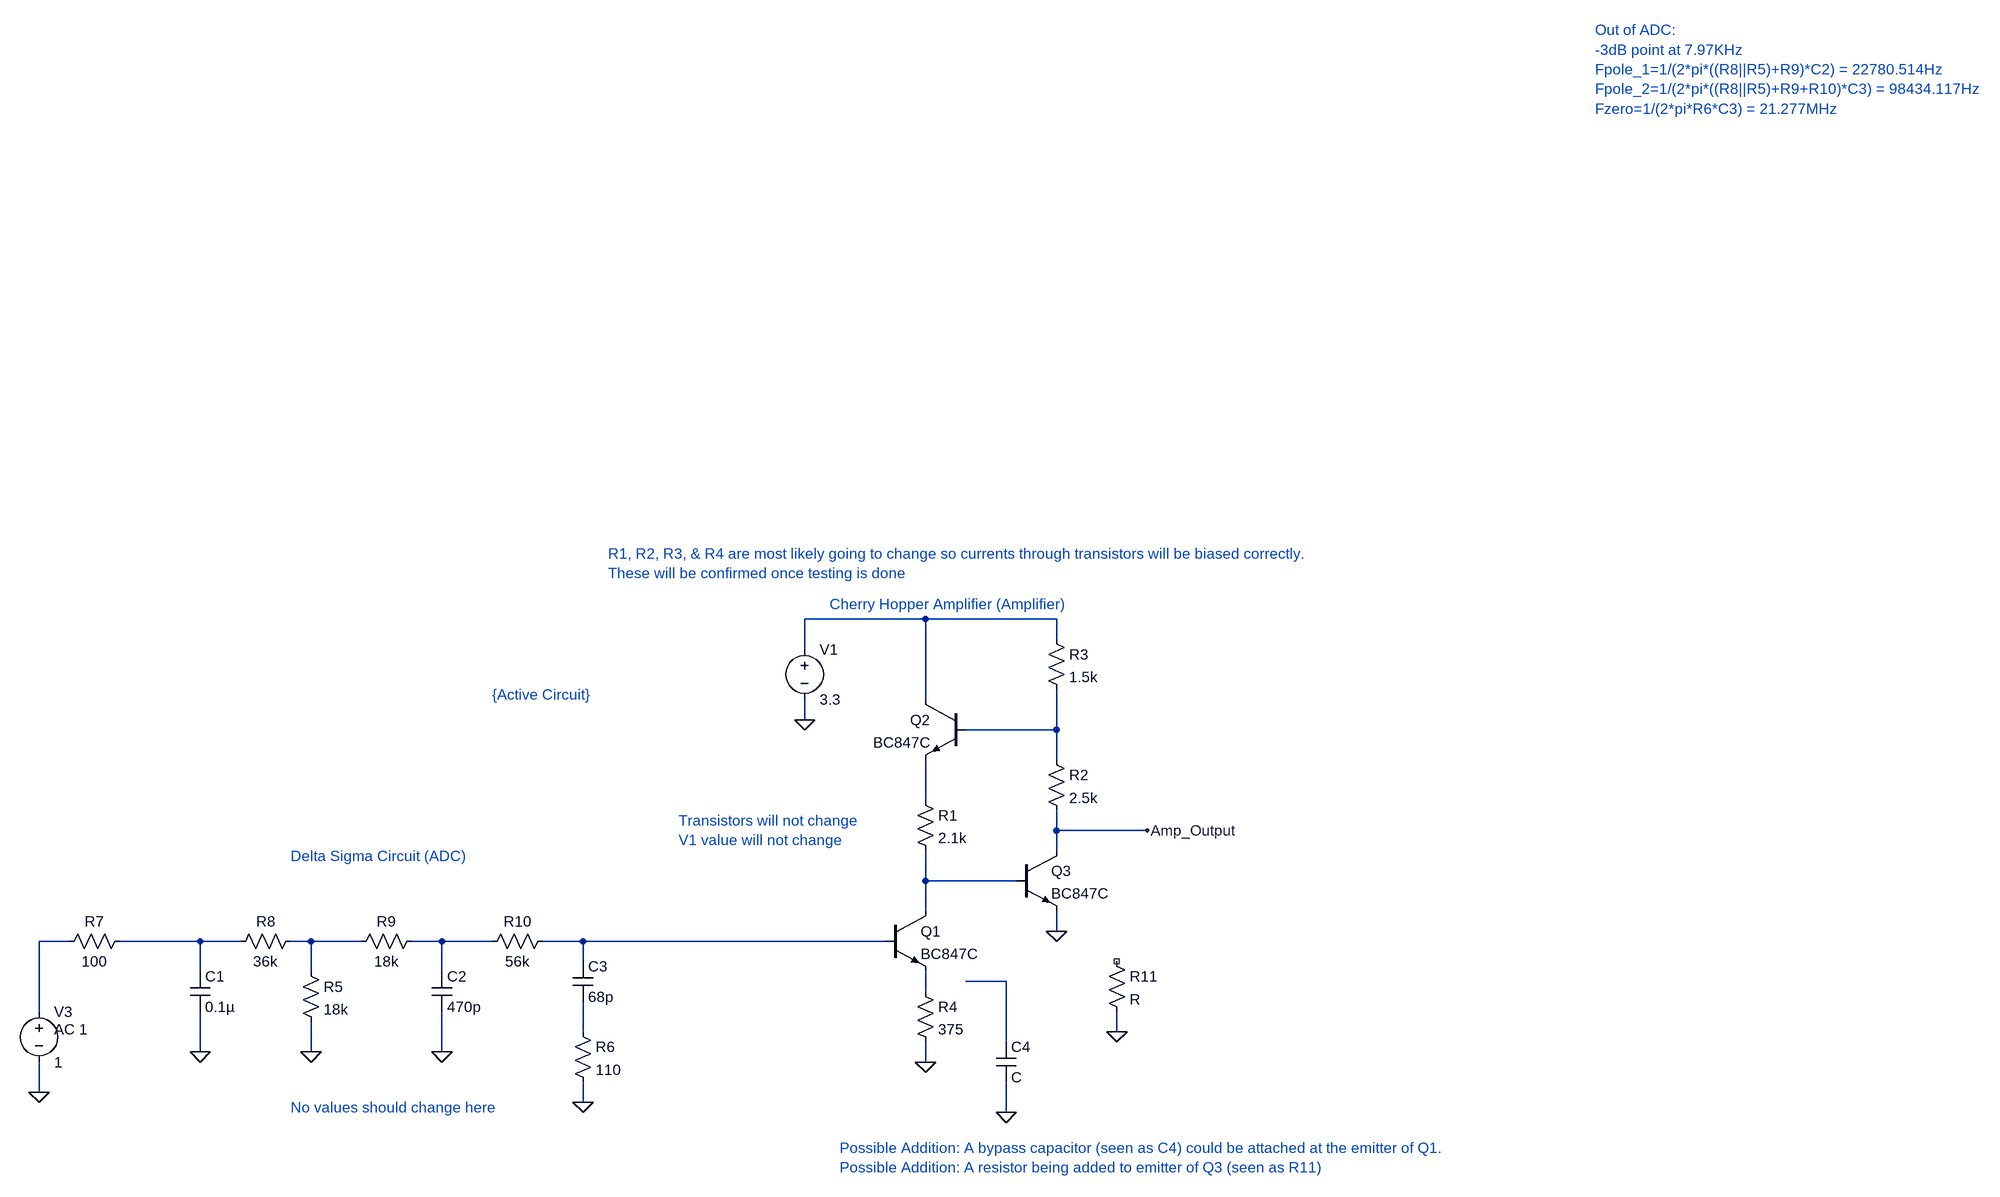
[diagram p0: schematic Active_Circuit_ADCAmp.asc]
Active_Circuit_ADCAmp.asc, the LTspice schematic file:
Version 4
SHEET 1 1812 680
WIRE -176 -816 -368 -816
WIRE 32 -816 -176 -816
WIRE 32 -784 32 -816
WIRE -368 -768 -368 -816
WIRE -176 -688 -176 -816
WIRE -368 -656 -368 -688
WIRE 32 -640 32 -704
WIRE 32 -640 -112 -640
WIRE 32 -592 32 -640
WIRE -176 -528 -176 -592
WIRE 32 -480 32 -512
WIRE 176 -480 32 -480
WIRE 32 -448 32 -480
WIRE -176 -400 -176 -448
WIRE -32 -400 -176 -400
WIRE -176 -352 -176 -400
WIRE 32 -320 32 -352
WIRE -1536 -304 -1584 -304
WIRE -1328 -304 -1456 -304
WIRE -1264 -304 -1328 -304
WIRE -1152 -304 -1184 -304
WIRE -1072 -304 -1152 -304
WIRE -944 -304 -992 -304
WIRE -864 -304 -944 -304
WIRE -720 -304 -784 -304
WIRE -240 -304 -720 -304
WIRE -720 -272 -720 -304
WIRE -1328 -256 -1328 -304
WIRE -1152 -256 -1152 -304
WIRE -944 -256 -944 -304
WIRE -48 -240 -112 -240
WIRE -176 -224 -176 -256
WIRE -1584 -192 -1584 -304
WIRE -720 -160 -720 -208
WIRE 128 -160 128 -192
WIRE -48 -144 -48 -240
WIRE -1328 -128 -1328 -192
WIRE -1152 -128 -1152 -176
WIRE -944 -128 -944 -192
WIRE -176 -112 -176 -144
WIRE -1584 -64 -1584 -112
WIRE -720 -48 -720 -80
WIRE -48 -32 -48 -80
FLAG 32 -320 0
FLAG -368 -656 0
FLAG -176 -112 0
FLAG -1584 -64 0
FLAG -1328 -128 0
FLAG -1152 -128 0
FLAG -944 -128 0
FLAG -720 -48 0
FLAG 176 -480 Amp_Output
FLAG -48 -32 0
FLAG 128 -160 0
SYMBOL npn -240 -352 R0
SYMATTR InstName Q1
SYMATTR Value BC847C
SYMBOL res -192 -544 R0
SYMATTR InstName R1
SYMATTR Value 2.1k
SYMBOL npn -112 -688 M0
SYMATTR InstName Q2
SYMATTR Value BC847C
SYMBOL npn -32 -448 R0
SYMATTR InstName Q3
SYMATTR Value BC847C
SYMBOL res 16 -608 R0
SYMATTR InstName R2
SYMATTR Value 2.5k
SYMBOL res 16 -800 R0
SYMATTR InstName R3
SYMATTR Value 1.5k
SYMBOL voltage -368 -784 R0
SYMATTR InstName V1
SYMATTR Value 3.3
SYMBOL res -192 -240 R0
SYMATTR InstName R4
SYMATTR Value 375
SYMBOL voltage -1584 -208 R0
WINDOW 123 24 44 Left 2
WINDOW 39 0 0 Left 0
SYMATTR Value2 AC 1
SYMATTR InstName V3
SYMATTR Value 1
SYMBOL res -1168 -272 R0
SYMATTR InstName R5
SYMATTR Value 18k
SYMBOL res -736 -176 R0
SYMATTR InstName R6
SYMATTR Value 110
SYMBOL res -1440 -320 R90
WINDOW 0 0 56 VBottom 2
WINDOW 3 32 56 VTop 2
SYMATTR InstName R7
SYMATTR Value 100
SYMBOL res -1168 -320 R90
WINDOW 0 0 56 VBottom 2
WINDOW 3 32 56 VTop 2
SYMATTR InstName R8
SYMATTR Value 36k
SYMBOL res -976 -320 R90
WINDOW 0 0 56 VBottom 2
WINDOW 3 32 56 VTop 2
SYMATTR InstName R9
SYMATTR Value 18k
SYMBOL res -768 -320 R90
WINDOW 0 0 56 VBottom 2
WINDOW 3 32 56 VTop 2
SYMATTR InstName R10
SYMATTR Value 56k
SYMBOL cap -1344 -256 R0
SYMATTR InstName C1
SYMATTR Value 0.1µ
SYMBOL cap -960 -256 R0
SYMATTR InstName C2
SYMATTR Value 470p
SYMBOL cap -736 -272 R0
SYMATTR InstName C3
SYMATTR Value 68p
SYMBOL cap -64 -144 R0
SYMATTR InstName C4
SYMBOL res 112 -288 R0
SYMATTR InstName R11
TEXT 888 -1752 Left 2 ;Out of ADC:\n-3dB point at 7.97KHz\nFpole_1=1/(2*pi*((R8||R5)+R9)*C2) = 22780.514Hz\nFpole_2=1/(2*pi*((R8||R5)+R9+R10)*C3) = 98434.117Hz\nFzero=1/(2*pi*R6*C3) = 21.277MHz
TEXT -864 -696 Left 2 ;{Active Circuit}
TEXT -1184 -440 Left 2 ;Delta Sigma Circuit (ADC)
TEXT -1184 -40 Left 2 ;No values should change here
TEXT -680 -920 Left 2 ;R1, R2, R3, & R4 are most likely going to change so currents through transistors will be biased correctly.\nThese will be confirmed once testing is done
TEXT -312 24 Left 2 ;Possible Addition: A bypass capacitor (seen as C4) could be attached at the emitter of Q1.\nPossible Addition: A resistor being added to emitter of Q3 (seen as R11)
TEXT -568 -496 Left 2 ;Transistors will not change \nV1 value will not change
TEXT -328 -840 Left 2 ;Cherry Hopper Amplifier (Amplifier)

The netlist it stands for:
* Active_Circuit_ADCAmp.asc
Q1 N004 N009 N011 0 BC847C
R1 N003 N004 2.1k
Q2 N001 N002 N003 0 BC847C
Q3 Amp_Output N004 0 0 BC847C
R2 N002 Amp_Output 2.5k
R3 N001 N002 1.5k
V1 N001 0 3.3
R4 N011 0 375
V3 N005 0 1 AC 1
R5 N007 0 18k
R6 N012 0 110
R7 N006 N005 100
R8 N007 N006 36k
R9 N008 N007 18k
R10 N009 N008 56k
C1 N006 0 0.1µ
C2 N008 0 470p
C3 N009 N012 68p
C4 N010 0 C
R11 NC_01 0 R
.model NPN NPN
.model PNP PNP
.lib standard.bjt
* Out of ADC:
* -3dB point at 7.97KHz
* Fpole_1=1/(2*pi*((R8||R5)+R9)*C2) = 22780.514Hz
* Fpole_2=1/(2*pi*((R8||R5)+R9+R10)*C3) = 98434.117Hz
* Fzero=1/(2*pi*R6*C3) = 21.277MHz
* {Active Circuit}
* Delta Sigma Circuit (ADC)
* No values should change here
* R1, R2, R3, & R4 are most likely going to change so currents through transistors will be biased correctly.
* These will be confirmed once testing is done
* Possible Addition: A bypass capacitor (seen as C4) could be attached at the emitter of Q1.
* Possible Addition: A resistor being added to emitter of Q3 (seen as R11)
* Transistors will not change
* V1 value will not change
* Cherry Hopper Amplifier (Amplifier)
.backanno
.end